# EAGLE design rfid_2te (EAGLE 5.04)
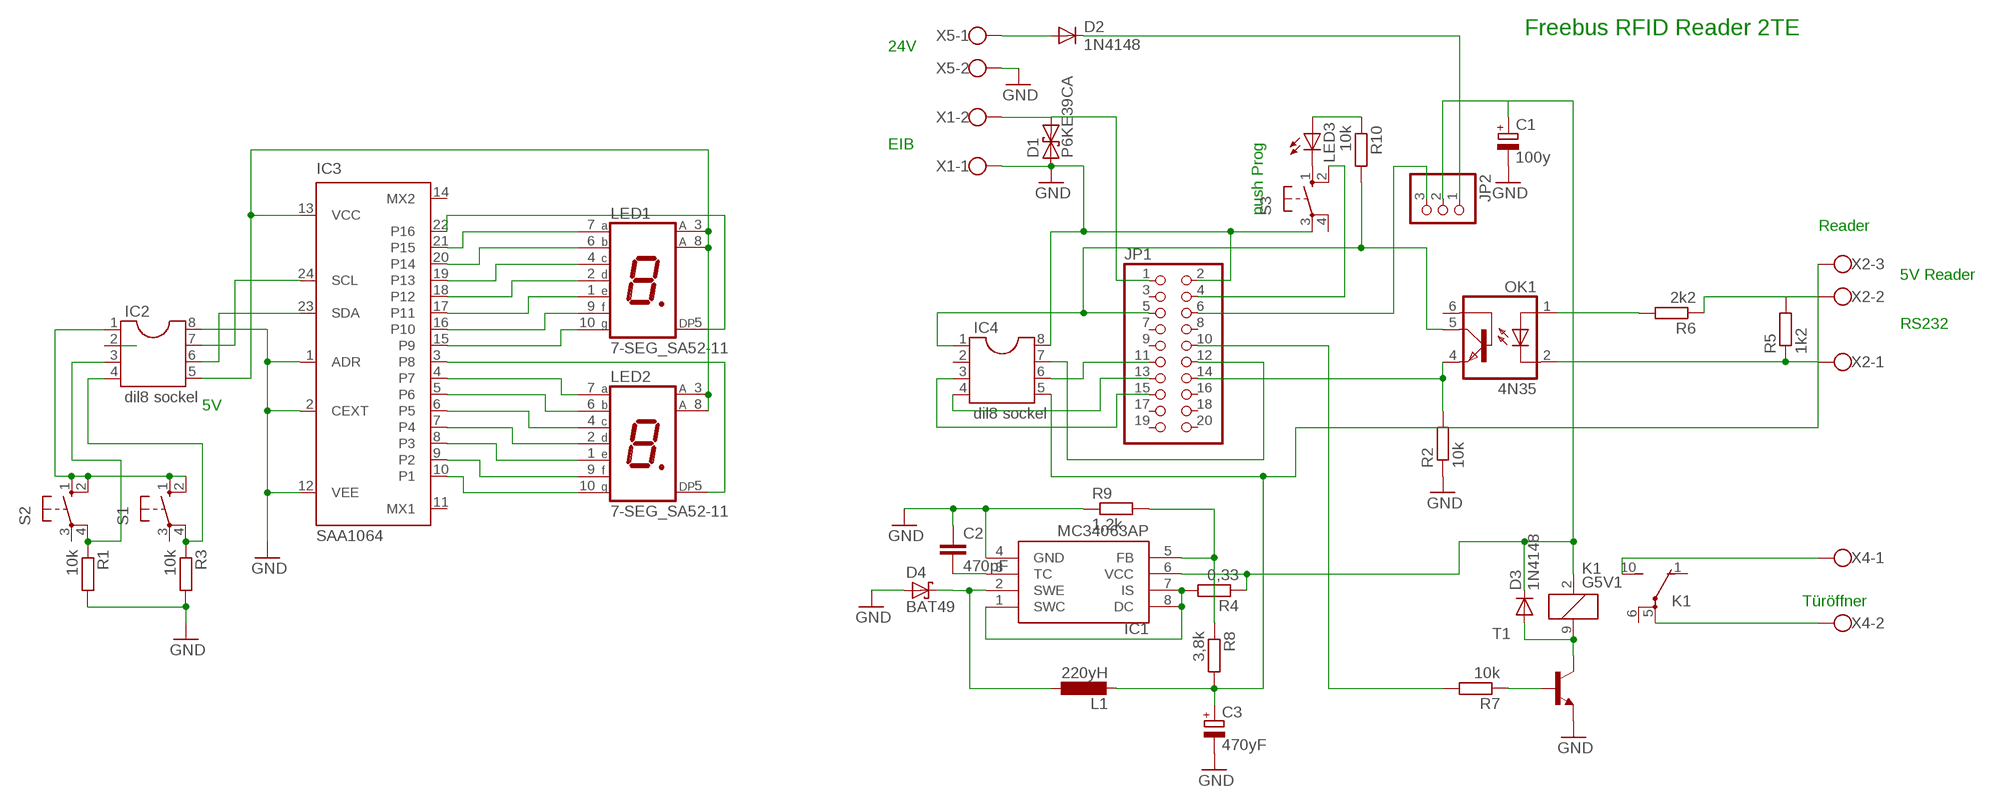
[diagram p0: schematic, sheet 1]

## Parts
C1  100y  CPOL-EUE3.5-8  [E3,5-8]
C2  470pF  C-EU025-024X044  [C025-024X044]
C3  470yF  CPOL-EUE5-8.5  [E5-8,5]
D1  P6KE39CA  P6KEXXC  [CB417-15]
D2  1N4148  1N4148DO35-10  [DO35-10]
D3  1N4148  1N4148DO35-10  [DO35-10]
D4  BAT49  [DO41-10]
IC1  MC34063AP  [DIL08]
IC2  dil8 sockel  DIL8S  [SOCKET-08]
IC3  SAA1064  [DIL24-6]
IC4  dil8 sockel  DIL8S  [SOCKET-08]
JP1  PINHD-2X10  [2X10]
JP2  PINHD-1X3  [1X03]
K1  G5V1  [G5V1]
L1  220yH  L-EU2200-12.7  [2200-12.7]
LED1  7-SEG_SA52-11  [SA52-11]
LED2  7-SEG_SA52-11  [SA52-11]
LED3  LED3MM  [LED3MM]
OK1  4N35  [DIL06]
R1  10k  R-EU_0207/10  [0207/10]
R2  10k  R-EU_0207/10  [0207/10]
R3  10k  R-EU_0207/10  [0207/10]
R4  0,33  R-EU_0207/10  [0207/10]
R5  1k2  R-EU_0207/10  [0207/10]
R6  2k2  R-EU_0207/10  [0207/10]
R7  10k  R-EU_0207/10  [0207/10]
R8  3,8k  R-EU_0207/10  [0207/10]
R9  1,2k  R-EU_0207/10  [0207/10]
R10  10k  R-EU_0207/10  [0207/10]
S1  10-XX  [B3F-10XX]
S2  10-XX  [B3F-10XX]
S3  10-XX  [B3F-10XX]
T1  -NPN-TO92  [TO92]
X1  W237-02P  [W237-132]
X2  W237-03P  [W237-133]
X4  W237-02P  [W237-132]
X5  W237-02P  [W237-132]

## Nets
GND: C1.- C2.1 C3.- D1.A D4.A IC1.4(GND) IC2.8 IC3.1(ADR) IC3.2(CEXT) IC3.12(VEE) IC4.8 JP1.2 R1.2 R2.1 R3.2 R9.1 S3.3(P) T1.1(E) X1.1 X5.2
N$1: IC3.10(P1) LED2.10(G)
N$2: JP1.14 OK1.4(EMI) R2.2
N$3: IC4.1 JP1.5 OK1.5(COL) R10.2
N$5: IC3.9(P2) LED2.9(F)
N$6: R5.2 R6.1 X2.2
N$7: JP1.6 JP2.3
N$8: IC3.8(P3) LED2.1(E)
N$9: OK1.2(C) R5.1 X2.1
N$10: OK1.1(A) R6.2
N$11: K1.10(2:S) X4.1
N$12: K1.5(2:P) X4.2
N$13: D2.A X5.1
N$14: D2.C JP2.1
N$15: D3.A K1.9 T1.3(C)
N$16: C1.+ D3.C IC1.6(VCC) JP2.2 K1.2 R4.1
N$17: R7.1 T1.2(B)
N$18: JP1.10 R7.2
N$19: IC3.7(P4) LED2.2(D)
N$20: IC3.6(P5) LED2.4(C)
N$21: IC3.5(P6) LED2.6(B)
N$22: IC3.4(P7) LED2.7(A)
N$23: IC3.3(P8) LED2.5(DP)
N$24: IC3.15(P9) LED1.10(G)
N$25: IC3.16(P10) LED1.9(F)
N$26: IC3.17(P11) LED1.1(E)
N$27: IC3.18(P12) LED1.2(D)
N$28: IC3.19(P13) LED1.4(C)
N$29: IC3.20(P14) LED1.6(B)
N$30: IC3.21(P15) LED1.7(A)
N$31: IC3.22(P16) LED1.5(DP)
N$32: IC2.6 IC3.23(SDA)
N$33: IC2.7 IC3.24(SCL)
N$34: IC2.1 S1.1(S) S1.2(S1) S2.1(S) S2.2(S1)
N$35: IC2.3 R1.1 S2.4(P1)
N$36: C2.2 IC1.3(TC)
N$37: IC2.5 IC3.13(VCC) LED1.3(A) LED1.8(A) LED2.3(A) LED2.8(A)
N$38: IC2.4 R3.1 S1.4(P1)
N$39: IC1.1(SWC) IC1.7(IS) IC1.8(DC) R4.2
N$40: IC1.5(FB) R8.1 R9.2
N$41: D4.C IC1.2(SWE) L1.1
N$43: IC4.4 JP1.13
N$45: LED3.K(C) S3.1(S)
N$46: IC4.7 JP1.12
N$47: IC4.6 JP1.11
N$48: IC4.3 JP1.15
N$51: C3.+ IC4.5 L1.2 R8.2 X2.3
N$52: LED3.A R10.1
N$54: JP1.4 S3.2(S1)
N$55: D1.C JP1.1 X1.2
Unconnected: IC2.2 IC3.11(MX1) IC3.14(MX2) IC4.2 JP1.3 JP1.7 JP1.8 JP1.9 JP1.16 JP1.17 JP1.18 JP1.19 JP1.20 K1.1(2:O) K1.6(2:P) OK1.6(BAS) S1.3(P) S2.3(P) S3.4(P1)

## Notes on the sheet
- Freebus RFID Reader 2TE
- 24V
- EIB
- push Prog
- Reader
- 5V Reader
- RS232
- 5V
- Türöffner

## Library data of the parts
C1 C3 = rcl:CPOL-EU: POLARIZED CAPACITOR, European symbol
C2 = rcl:C-EU: CAPACITOR, European symbol
D1 = diode:P6KEXXC: DIODE transient-voltage suppressor
D2 D3 = diode:1N4148: DIODE high speed (Philips)
D4 = diode:BAT49: DIODE small signal diode
IC1 = mc34063:MC34063
IC2 IC4 = ic-package:DIL8: Dual In Line / Socket
IC3 = micro-philips:SAA1064: I2C-Bus 4-digit LED-DRIVER
JP1 = pinhead:PINHD-2X10: PIN HEADER
JP2 = pinhead:PINHD-1X3: PIN HEADER
K1 = relay:G5V1: RELAY 1 x switch, 0.5 A/125 V AC, 1 A/24 V DC , Omron
L1 = rcl:L-EU: INDUCTOR, European symbol
LED1 LED2 = display-kingbright:7-SEG_: Kingbright 14.2mm (0.56 INCH) SINGLE DIGIT NUMERIC DUISPLAY Source: SA56-11EWA(Ver1189471036.pdf
LED3 = led:LED: LED OSRAM: - CHIPLED LG R971, LG N971, LY N971, LG Q971, LY Q971, LO R971, LY R971 LH N974, LH R974 LS Q976, LO Q976, LY Q976 LO Q996 - Hyper CHIPLED LW Q18S LB Q993, LB Q99A, LB R99A - SideLED LS A670, LO A670, LY A670, LG A670, LP A670 LB A673, LV A673, LT A673, LW A673 LH A674 LY A675 LS A676, LA A676, LO A676, LY A676, LW A676 LS A679, LY A679, LG A679 - Hyper Micro SIDELED® LS Y876, LA Y876, LO Y876, LY Y876 LT Y87S - SmartLED LW L88C, LW L88S LB L89C, LB L89S, LG L890 LS L89K, LO L89K, LY L89K LS L896, LA L896, LO L896, LY L896 - TOPLED LS T670, LO T670, LY T670, LG T670, LP T670 LSG T670, LSP T670, LSY T670, LOP T670, LYG T670 LG T671, LOG T671, LSG T671 LB T673, LV T673, LT T673, LW T673 LH T674 LS T676, LA T676, LO T676, LY T676, LB T676, LH T676, LSB T676, LW T676 LB T67C, LV T67C, LT T67C, LS T67K, LO T67K, LY T67K, LW E67C LS E67B, LA E67B, LO E67B, LY E67B, LB E67C, LV E67C, LT E67C LW T67C LS T679, LY T679, LG T679 LS T770, LO T770, LY T770, LG T770, LP T770 LB T773, LV T773, LT T773, LW T773 LH T774 LS E675, LA E675, LY E675, LS T675 LS T776, LA T776, LO T776, LY T776, LB T776 LHGB T686 LT T68C, LB T68C - Hyper Mini TOPLED® LB M676 - Mini TOPLED Santana® LG M470 LS M47K, LO M47K, LY M47K Source: http://www.osram.convergy.de LUXEON: - LUMILED® LXK2-PW12-R00, LXK2-PW12-S00, LXK2-PW14-U00, LXK2-PW14-V00 LXK2-PM12-R00, LXK2-PM12-S00, LXK2-PM14-U00 LXK2-PE12-Q00, LXK2-PE12-R00, LXK2-PE12-S00, LXK2-PE14-T00, LXK2-PE14-U00 LXK2-PB12-K00, LXK2-PB12-L00, LXK2-PB12-M00, LXK2-PB14-N00, LXK2-PB14-P00, LXK2-PB14-Q00 LXK2-PR12-L00, LXK2-PR12-M00, LXK2-PR14-Q00, LXK2-PR14-R00 LXK2-PD12-Q00, LXK2-PD12-R00, LXK2-PD12-S00 LXK2-PH12-R00, LXK2-PH12-S00 LXK2-PL12-P00, LXK2-PL12-Q00, LXK2-PL12-R00 Source: www.luxeon.com KINGBRIGHT: KA-3528ASYC Source: www.kingbright.com
OK1 = optocoupler:4N35: MOTOROLA OPTO COUPLER
R1-R10 = rcl:R-EU_: RESISTOR, European symbol
S1-S3 = switch-omron:10-XX: OMRON SWITCH
T1 = transistor:*-NPN-: NPN Transistror BF959 corrected 2008.03.06
X1 X4 X5 = con-wago-508:W237-02P: WAGO SREW CLAMP
X2 = con-wago-508:W237-03P: WAGO SREW CLAMP

## Board
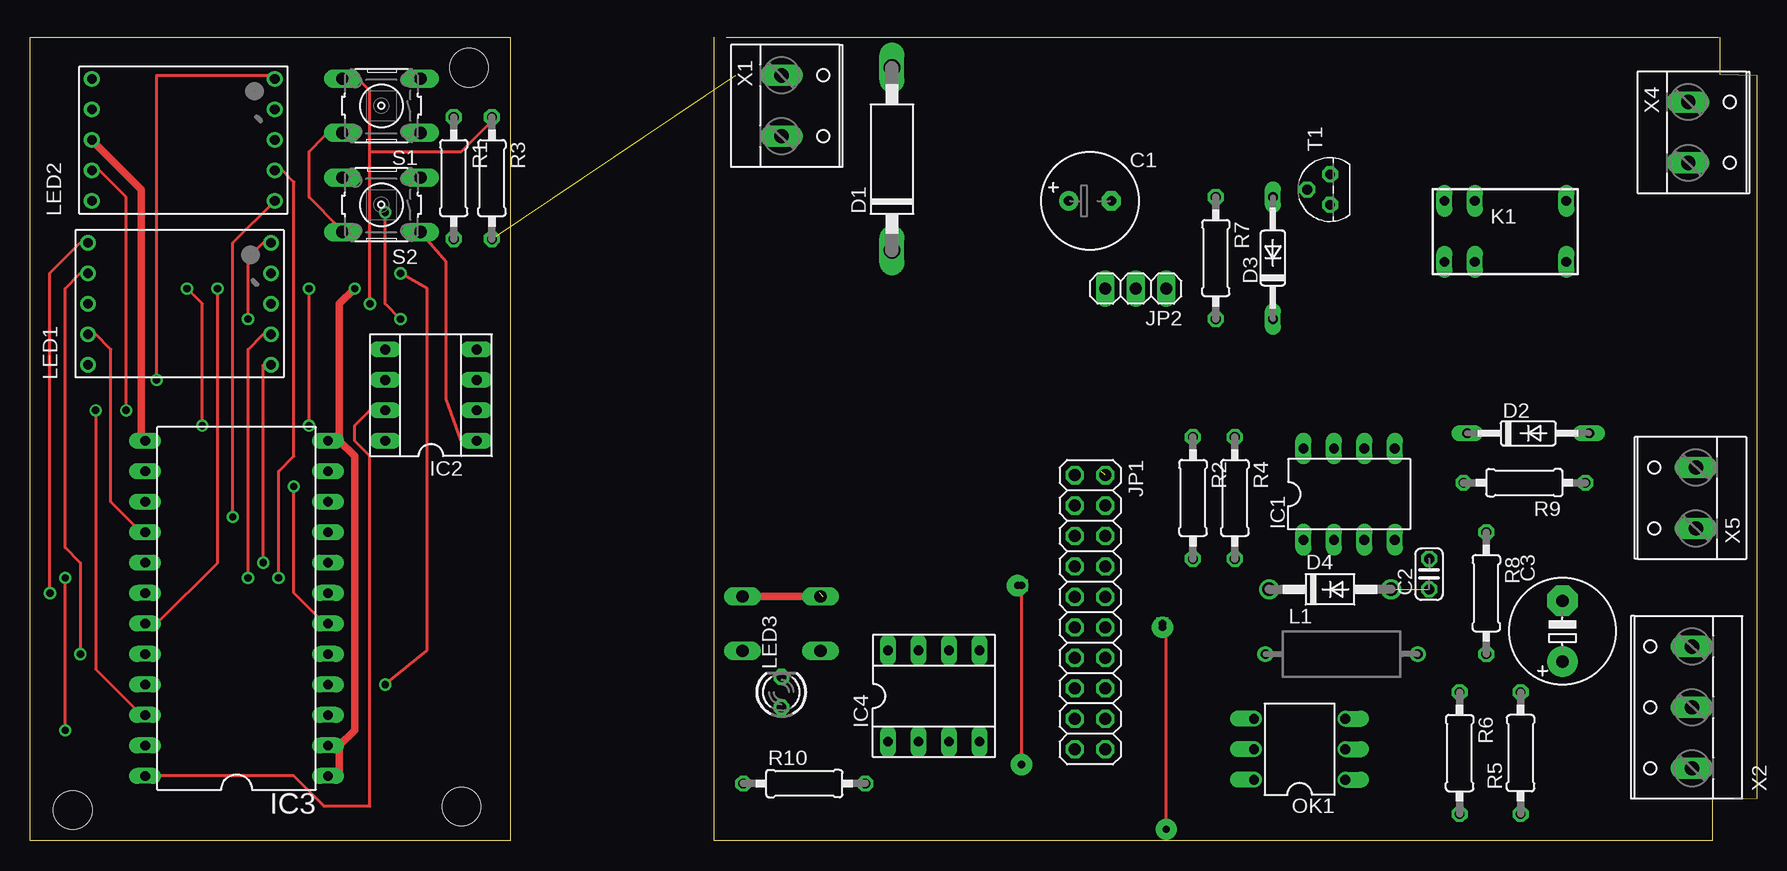
[diagram p1: board, top side]
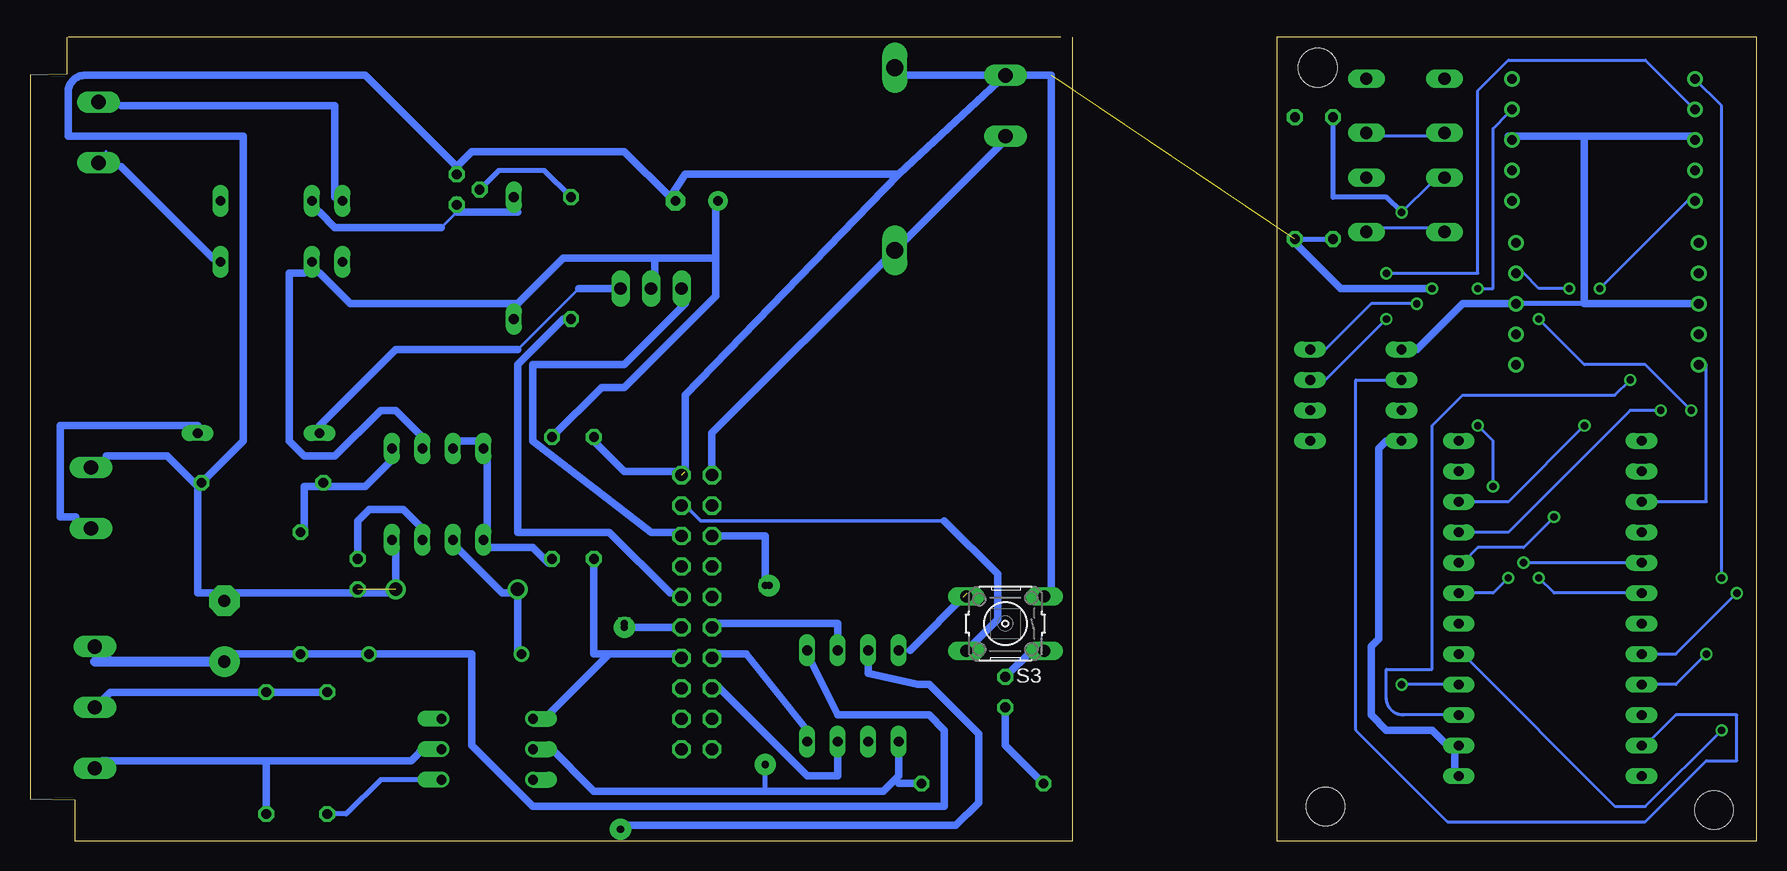
[diagram p2: board, bottom side, seen from below]

Size 143.9 x 67 mm. Coordinates in mm from the lower left corner, seen from the top.
Outline: 58,67 140.72,67
Outline: 140.82,67 140.82,63.92 143.9,63.82 143.9,3.5 140.19,3.39 140.19,0 57,0 57,67
Outline: 0,67 40,67 40,0 0,0 0,67
Copper layers (1*16): Top 0.035mm / dielectric 1.5mm / Bottom 0.035mm
Design rules "default *": minimum track width 10mil, minimum drill 24mil, track to track 20mil, track to pad 20mil, pad to pad 12mil, via to via 12mil, smd to smd 8mil, copper to edge 12mil, drill to drill 8mil, minimum pad ring 10mil, minimum via ring 8mil, stop-mask expansion 4mil, vias tented up to drill 0mil, thermal gap 10mil
Holes 3.2 mm at 35.95,2.86 3.56,2.54 36.59,64.45

### Footprints (pad centres in the part's own frame; a part is rotated, then mirrored left to right if it is on the bottom)
E3,5-8 = drill 0.813 pad 1.6 round: + -1.778,0 | drill 0.813 pad 1.6 octagon: - 1.778,0
C025-024X044 = drill 0.813 octagon: 1 -1.27,0; 2 1.27,0
E5-8,5 = drill 1.016 pad 2.54 round: + -2.54,0 | drill 1.016 pad 2.54 octagon: - 2.54,0
CB417-15 = drill 1.397 long: A 7.62,0; C -7.62,0
DO35-10 = drill 0.813 long: A 5.08,0; C -5.08,0
DO41-10 = drill 1.118 round: A 5.08,0; C -5.08,0
DIL08 = drill 0.813 long: 1 -3.81,-3.81; 2 -1.27,-3.81; 3 1.27,-3.81; 4 3.81,-3.81; 5 3.81,3.81; 6 1.27,3.81; 7 -1.27,3.81; 8 -3.81,3.81
SOCKET-08 = drill 0.813 long: 1 -3.81,-3.81; 2 -1.27,-3.81; 3 1.27,-3.81; 4 3.81,-3.81; 5 3.81,3.81; 6 1.27,3.81; 7 -1.27,3.81; 8 -3.81,3.81
DIL24-6 = drill 0.813 long: 1 -13.97,-7.62; 2 -11.43,-7.62; 3 -8.89,-7.62; 4 -6.35,-7.62; 5 -3.81,-7.62; 6 -1.27,-7.62; 7 1.27,-7.62; 8 3.81,-7.62; 9 6.35,-7.62; 10 8.89,-7.62; 11 11.43,-7.62; 12 13.97,-7.62; 13 13.97,7.62; 14 11.43,7.62; 15 8.89,7.62; 16 6.35,7.62; 17 3.81,7.62; 18 1.27,7.62; 19 -1.27,7.62; 20 -3.81,7.62; 21 -6.35,7.62; 22 -8.89,7.62; 23 -11.43,7.62; 24 -13.97,7.62
2X10 = drill 1.016 octagon: 1 -11.43,-1.27; 2 -11.43,1.27; 3 -8.89,-1.27; 4 -8.89,1.27; 5 -6.35,-1.27; 6 -6.35,1.27; 7 -3.81,-1.27; 8 -3.81,1.27; 9 -1.27,-1.27; 10 -1.27,1.27; 11 1.27,-1.27; 12 1.27,1.27; 13 3.81,-1.27; 14 3.81,1.27; 15 6.35,-1.27; 16 6.35,1.27; 17 8.89,-1.27; 18 8.89,1.27; 19 11.43,-1.27; 20 11.43,1.27
1X03 = drill 1.016 long: 1 -2.54,0; 2 0,0; 3 2.54,0
G5V1 = drill 0.813 long: 1 -5.08,-2.54; 2 -2.54,-2.54; 5 5.08,-2.54; 6 5.08,2.54; 9 -2.54,2.54; 10 -5.08,2.54
2200-12.7 = drill 0.8 pad 1.27 round: 1 -6.35,0; 2 6.35,0
SA52-11 = drill 0.8 round: 1 -5.08,-7.62; 2 -2.54,-7.62; 3 0,-7.62; 4 2.54,-7.62; 5 5.08,-7.62; 6 5.08,7.62; 7 2.54,7.62; 8 0,7.62; 9 -2.54,7.62; 10 -5.08,7.62
LED3MM = drill 0.813 octagon: A -1.27,0; K 1.27,0
DIL06 = drill 0.813 offset: 1 -2.54,-3.81; 2 0,-3.81; 3 2.54,-3.81; 4 2.54,3.81; 5 0,3.81; 6 -2.54,3.81
0207/10 = drill 0.813 octagon: 1 -5.08,0; 2 5.08,0
B3F-10XX = drill 1.016 long: 1 -3.251,2.261; 2 3.251,2.261; 3 -3.251,-2.261; 4 3.251,-2.261
TO92 = drill 0.813 octagon: 1 1.27,0; 2 0,1.905; 3 -1.27,0
W237-132 = drill 1.194 long: 1 -2.54,-0.635; 2 2.54,-0.635
W237-133 = drill 1.194 long: 1 -5.08,-0.635; 2 0,-0.635; 3 5.08,-0.635

### Placement (x,y rotation side)
C1  88.34,53.34 0 top
C2  116.59,22.23 90 top
C3  127.71,17.47 90 top
D1  71.83,56.83 90 top
D2  124.85,33.98 0 top
D3  103.58,48.58 90 top
D4  108.34,20.96 0 top
IC1  109.93,28.9 0 top
IC2  33.41,37.15 90 top
IC3  17.22,19.37 90 top
IC4  75.32,12.07 0 top
JP1  88.34,19.05 270 top
JP2  92.15,46.04 180 top
K1  122.94,50.8 0 top
L1  109.29,15.56 0 top
LED1  12.45,44.77 90 top
LED2  12.77,58.42 90 top
LED3  62.62,12.38 90 top
OK1  105.8,7.62 90 top
R1  35.31,55.25 270 top
R2  96.91,28.58 270 top
R3  38.49,55.25 270 top
R4  100.4,28.58 270 top
R5  124.22,7.3 90 top
R6  119.14,7.3 270 top
R7  98.81,48.58 270 top
R8  121.36,20.64 270 top
R9  124.53,29.85 180 top
R10  64.53,4.77 0 top
S1  29.28,61.28 180 top
S2  29.28,53.03 180 top
S3  62.62,18.1 180 bottom
T1  108.34,54.3 90 top
X1  63.26,61.28 270 top
X2  137.87,11.11 90 top
X4  138.82,59.06 270 top
X5  138.19,28.58 90 top

### Tracks (layer width: path | path; a pad name or v marks a point on that pad's centre or on a via)
GND  (via drill 0.61)  (4 unrouted)
  Top 0.254: 25.79,5.4 IC3.1 | IC3.2 25.79,7.94 | 25.79,33.34 IC3.12 | D1.A 71.51,62.55
  Top 0.61: 25.79,5.4 25.79,7.94 27.06,9.21 27.06,32.07 25.79,33.34 25.79,44.77 v27.06,46.04 | S3.3 66.07,20.36 66.11,20.32
  Bottom 0.254: 38.49,49.85 R3.2 | 137.55,32.07 X5.2 | 113.42,24.45 IC1.4 | 113.42,20.64 D4.A | 127.39,20.64 C3.- 128.66,20.64 | 96.91,33.34 R2.1 | 71.51,63.82 D1.A | 90.56,53.66 C1.- | R9.1 129.93,29.53 | 108.34,56.2 T1.1
  Bottom 0.305: 70.56,15.88 IC4.8
  Bottom 0.406: R3.2 R1.2
  Bottom 0.61: 38.49,49.85 34.68,46.04 v27.06,46.04 | IC2.8 30.87,33.34 31.5,32.7 31.5,16.83 32.14,16.2 32.14,10.48 30.87,9.21 27.06,9.21 25.79,7.94 25.16,7.94 | IC3.2 25.16,7.94 | 137.55,32.07 132.47,32.07 129.93,29.53 129.93,20.64 128.66,20.64 | D4.A 113.42,24.45 | 127.39,20.64 113.42,20.64 | 96.91,33.34 94.37,30.8 89.29,30.8 89.29,37.15 71.51,55.56 | X1.1 58.81,63.82 58.81,20.92 S3.3 | X1.1 71.51,63.82 | X1.1 71.51,55.56 | 71.51,55.56 89.29,55.56 90.56,53.66 94.37,57.47 107.07,57.47 108.34,56.2 115.96,63.82 139.31,63.82 arc-90 140.72,62.4 140.72,58.74 126.12,58.74 126.12,33.34 R9.1 | 25.16,7.94 25.16,5.4 | 65.8,20.64 70.56,15.88
N$1  (via drill 0.61)
  Top 0.254: v13.09,46.04 14.36,44.77 v14.36,34.61
  Bottom 0.254: v13.09,46.04 5.47,53.66 LED2.10 | v14.36,34.61 20.71,28.26 IC3.10
N$2
  Bottom 0.254: JP1.14 89.29,15.56 | 100.72,10.48 OK1.4
  Bottom 0.61: 89.29,15.56 95.64,15.56 | 95.64,15.56 96.91,15.56 R2.2 | 95.64,15.56 100.72,10.48
N$3  (via drill 0.6)  (1 unrouted)
  Top 0.254: v82.62,21.27 82.62,6.35
  Bottom 0.254: 100.72,7.94 OK1.5 | 71.51,4.77 71.51,5.4
  Bottom 0.406: 82.62,4.13 82.62,6.35
  Bottom 0.61: 100.72,7.94 96.91,4.13 82.62,4.13 72.78,4.13 71.51,5.4 IC4.1 | JP1.5 82.62,25.4 v82.62,21.27 | R10.2 71.51,4.77
N$5  (via drill 0.61)
  Top 0.254: v8.01,35.88 8.01,53.66 5.47,56.2 LED2.9
  Bottom 0.254: v8.01,35.88 10.55,35.88 20.71,25.72 IC3.9
N$6
  Bottom 0.61: R6.1 R5.2 137.23,12.38 X2.2
N$7
  Bottom 0.254: JP1.6 89.29,25.72 | 89.29,44.77 JP2.3
  Bottom 0.61: 89.29,25.72 92.15,25.72 101.99,33.34 101.99,39.69 94.37,39.69 89.29,44.77
N$8  (via drill 0.61)
  Top 0.254: v16.9,26.99 16.9,49.85 LED2.1 20.71,53.66
  Bottom 0.254: v16.9,26.99 19.44,24.45 23.25,24.45 24.52,23.18 IC3.8
N$9
  Bottom 0.254: OK1.2 110.88,7.94 | X2.1 138.82,6.67
  Bottom 0.406: 123.9,6.67 124.22,6.35 | 137.87,6.67 X2.1
  Bottom 0.61: 110.88,7.94 112.15,6.67 123.9,6.67 137.87,6.67 | 124.22,6.35 R5.1
N$10
  Bottom 0.406: R6.2 117.55,2.23 114.69,5.08 OK1.1
N$11
  Bottom 0.254: K1.10 118.5,53.66 | 136.28,61.28 X4.1
  Bottom 0.61: 118.5,53.66 118.5,61.28 136.28,61.28
N$12
  Bottom 0.254: 137.55,57.47 X4.2 136.28,56.2 | K1.5 128.66,48.58
  Bottom 0.61: 128.66,48.58 136.28,56.2
N$13
  Bottom 0.254: D2.A 129.93,34.61 | 140.09,26.99 X5.1
  Bottom 0.61: 129.93,34.61 141.36,34.61 141.36,26.99 140.09,26.99
N$14
  Bottom 0.254: 98.18,46.04 103.26,40.96 | 119.77,34.61 D2.C | JP2.1 94.37,46.04
  Bottom 0.61: 119.77,34.61 113.42,40.96 103.26,40.96 | JP2.1 98.18,46.04
N$15
  Bottom 0.254: 103.26,52.39 D3.A | 108.34,53.66 T1.3 108.34,52.39 109.61,51.12 | 119.77,52.39 K1.9
  Bottom 0.61: 103.26,52.39 108.34,52.39 | 119.77,52.39 118.5,51.12 109.61,51.12
N$16
  Bottom 0.254: 110.88,33.34 IC1.6 | 121.04,47.31 K1.2 119.77,47.31 | R4.1 100.72,33.34 | 86.75,53.66 C1.+ | 91.83,47.31 JP2.2 | 103.26,44.77 D3.C
  Bottom 0.61: 110.88,33.34 113.42,35.88 114.69,35.88 118.5,32.07 121.04,32.07 122.31,33.34 122.31,47.31 121.04,47.31 | R4.1 96.28,37.78 94.37,37.78 86.75,45.41 86.75,48.58 | 86.75,48.58 86.75,53.66 | 86.75,48.58 91.83,48.58 | 91.83,48.58 99.45,48.58 103.26,44.77 117.23,44.77 119.77,47.31 | 91.83,48.58 91.83,47.31
N$17
  Bottom 0.406: R7.1 101.04,55.88 104.85,55.88 T1.2
N$18
  Bottom 0.254: 90.56,20.64 89.29,20.64 JP1.10 | 99.45,43.5 R7.2
  Bottom 0.61: 99.45,43.5 103.26,39.69 103.26,25.72 95.64,25.72 90.56,20.64
N$19  (via drill 0.61)
  Top 0.254: v20.71,21.91 20.71,30.8 21.98,32.07 21.98,54.93 20.71,56.2 LED2.2
  Bottom 0.254: v20.71,21.91 21.98,20.64 IC3.7
N$20  (via drill 0.61)
  Top 0.254: v23.25,34.61 v23.25,46.04 | v21.98,29.53 21.98,20.64 24.52,18.1 IC3.6
  Bottom 0.254: v23.25,46.04 21.98,46.04 21.98,59.38 20.71,60.64 20.71,61.28 LED2.4 | v23.25,34.61 21.98,33.34 v21.98,29.53
N$21  (via drill 0.61)
  Top 0.254: v2.93,9.21 v2.93,21.91
  Bottom 0.254: v2.93,21.91 2.93,61.28 LED2.6 5.47,63.82 | v2.93,9.21 9.28,2.86 11.82,2.86 24.52,15.56 IC3.5
N$22  (via drill 0.61)
  Top 0.254: v30.87,47.31 33.09,46.04 33.09,15.88 v29.6,13.02
  Bottom 0.254: v30.87,47.31 23.25,47.31 23.25,62.55 20.71,65.09 9.28,65.09 LED2.7 | IC3.4 v29.6,13.02
N$23  (via drill 0.61)
  Top 0.254: v10.55,38.42 10.55,63.82 20.71,63.82 LED2.5
  Bottom 0.254: v10.55,38.42 11.82,37.15 24.52,37.15 27.06,34.61 27.06,14.29 30.87,14.29 30.87,11.9 arc-90 29.45,10.48 IC3.3
N$24
  Bottom 0.254: LED1.10 4.2,39.69 4.2,28.26 IC3.15
N$25
  Top 0.254: LED1.9 5.47,42.23 6.74,40.96 6.74,28.26 9.28,25.72 IC3.16
N$26  (via drill 0.61)
  Top 0.254: v19.44,23.18 19.44,39.69 LED1.1
  Bottom 0.254: IC3.17 v19.44,23.18
N$27  (via drill 0.61)
  Top 0.254: v18.17,21.91 18.17,40.96 19.44,42.23 LED1.2
  Bottom 0.254: v18.17,21.91 16.9,20.64 IC3.18
N$28  (via drill 0.61)
  Top 0.254: v15.63,46.04 15.63,23.18 10.55,18.1 IC3.19
  Bottom 0.254: v15.63,46.04 18.17,46.04 19.44,47.31 LED1.4
N$29  (via drill 0.61)
  Top 0.254: v1.66,20.64 1.66,47.31 4.2,49.85 LED1.6
  Bottom 0.254: v1.66,20.64 6.74,15.56 IC3.20
N$30  (via drill 0.61)
  Top 0.254: v4.2,15.56 4.2,23.18 2.93,24.45 2.93,46.04 4.2,47.31 LED1.7
  Bottom 0.254: v4.2,15.56 6.74,13.02 IC3.21
N$31  (via drill 0.61)
  Top 0.254: v18.17,43.5 18.17,48.58 19.44,49.85 LED1.5 | v5.47,35.88 5.47,14.29 9.28,10.48 IC3.22
  Bottom 0.254: v18.17,43.5 14.36,39.69 9.28,39.69 v5.47,35.88
N$32
  Bottom 0.254: IC3.23 9.28,7.94 6.74,10.48 1.66,10.48 1.66,6.67 4.2,6.67 9.28,1.59 25.79,1.59 33.41,9.21 33.41,38.42 IC2.6
N$33
  Top 0.254: IC3.24 21.98,5.4 24.52,2.86 28.33,2.86 28.33,32.07 27.06,33.34 27.06,34.61 28.33,35.88 IC2.7
N$34
  Top 0.254: IC2.1 35.95,33.34 34.68,36.83 34.68,48.26 S2.1 | S1.2 24.52,58.74 23.25,57.47 23.25,53.66 25.79,51.12 S2.2
  Bottom 0.254: S1.2 27.06,58.74 32.14,58.74 S1.1 | S2.2 27.06,51.12 32.14,51.12 S2.1
N$35  (via drill 0.61)
  Top 0.254: v30.87,43.5 29.6,44.77 v29.6,52.39
  Bottom 0.254: v30.87,43.5 35.95,38.42 IC2.3 | v29.6,52.39 27.06,54.93 S2.4
  Bottom 0.406: R1.1 35.31,53.66 30.87,53.66 v29.6,52.39
N$36
  Bottom 0.406: IC1.3 111.2,26.04
  Bottom 0.61: 111.2,26.04 112.78,27.62 115.64,27.62 116.59,26.67 C2.2
N$37
  Top 0.254: 9.28,33.34 IC3.13
  Top 0.61: 9.28,33.34 9.28,54.3 LED2.8
  Bottom 0.254: 28.33,40.96 IC2.5 | LED2.8 5.47,58.74 | 20.71,58.74 LED2.3
  Bottom 0.406: 14.36,44.77 LED1.3
  Bottom 0.61: LED1.8 14.36,44.77 14.36,58.74 | 28.33,40.96 24.52,44.77 LED1.3 | 14.36,58.74 20.71,58.74 | 5.47,58.74 14.36,58.74
N$38  (via drill 0.61)
  Top 0.254: 28.33,57.47 28.33,62.55 27.06,63.82 S1.4 | v28.33,44.77 28.33,57.47 | 28.33,57.47 35.95,57.47 38.49,60.01 R3.1
  Bottom 0.254: v28.33,44.77 32.14,44.77 35.95,40.96 IC2.4
N$39
  Bottom 0.254: 105.8,33.34 IC1.8 105.8,32.07 | 108.34,33.34 IC1.7 | R4.2 100.72,23.18 | 105.8,24.45 IC1.1 105.8,25.72
  Bottom 0.61: 105.8,33.34 108.34,33.34 | 100.72,23.18 101.99,24.45 105.8,24.45 | 105.8,25.72 105.8,32.07
N$40
  Bottom 0.254: 121.04,25.72 R8.1 | IC1.5 113.42,32.07 | 119.77,29.53 R9.2
  Bottom 0.61: 121.04,25.72 121.04,29.53 119.77,29.53 115.96,29.53 113.42,32.07
N$41
  Bottom 0.254: L1.1 103.26,15.56 | 108.34,24.45 IC1.2 | 103.26,20.64 D4.C
  Bottom 0.61: 103.26,15.56 103.26,20.64 104.53,20.64 108.34,24.45
N$42  (via drill 0.6 pad 1.78)
  Top 0.254: v82.31,21.27 82.94,21.27
N$43
  Bottom 0.254: IC4.4 79.13,9.21 | 86.75,15.56 JP1.13
  Bottom 0.61: 79.13,9.21 84.21,15.56 86.75,15.56
N$44  (via drill 0.6 pad 1.78)
  other vias: 82.62,6.35
N$45
  Bottom 0.61: S3.1 60.44,15.84 LED3.K
N$46  (via drill 0.6, 0.6 pad 1.78)
  Top 0.254: v94.37,18.1 94.69,18.1 v94.69,0.95
  Bottom 0.254: 94.37,1.27 v94.69,0.95 | v94.37,18.1 94.37,17.78
  Bottom 0.61: IC4.7 74.05,13.97 69.92,13.02 68.97,13.02 64.84,8.89 64.84,3.18 66.75,1.27 94.37,1.27 | 94.37,17.78 JP1.12
N$47
  Bottom 0.254: 86.75,18.1 JP1.11
  Bottom 0.61: 86.75,18.1 76.59,18.1 IC4.6
N$48
  Bottom 0.254: 86.75,13.02 JP1.15
  Bottom 0.61: 86.75,13.02 79.13,5.4 76.59,5.4 IC4.3
N$50  (via drill 0.6 pad 1.78)
  other vias: 94.37,17.78
N$51
  Bottom 0.254: 79.13,15.56 IC4.5
  Bottom 0.406: 138.5,14.92 X2.3
  Bottom 0.61: C3.+ 127.07,15.56 R8.2 L1.2 107.07,15.56 107.07,7.94 101.99,2.86 67.7,2.86 67.7,9.21 68.97,10.48 76.59,10.48 79.13,15.56
  Bottom 0.813: X2.3 137.23,14.92 | C3.+ 138.5,14.92
N$52
  Bottom 0.61: LED3.A 62.62,7.94 R10.1
N$53
  Top 0.254: 94.37,17.47 95,17.47
N$54
  Bottom 0.305: JP1.4 89.29,27.94 88.02,26.67 67.7,26.67
  Bottom 0.61: 67.7,26.67 63.26,22.23 63.26,18.46 S3.2
N$55
  Bottom 0.61: X1.2 62.62,58.42 D1.C 87.07,33.98 JP1.1